# Altium schematic sheet COMM.SchDoc
size 420 x 297 mm; SheetNumber: 15; SheetTotal: 32
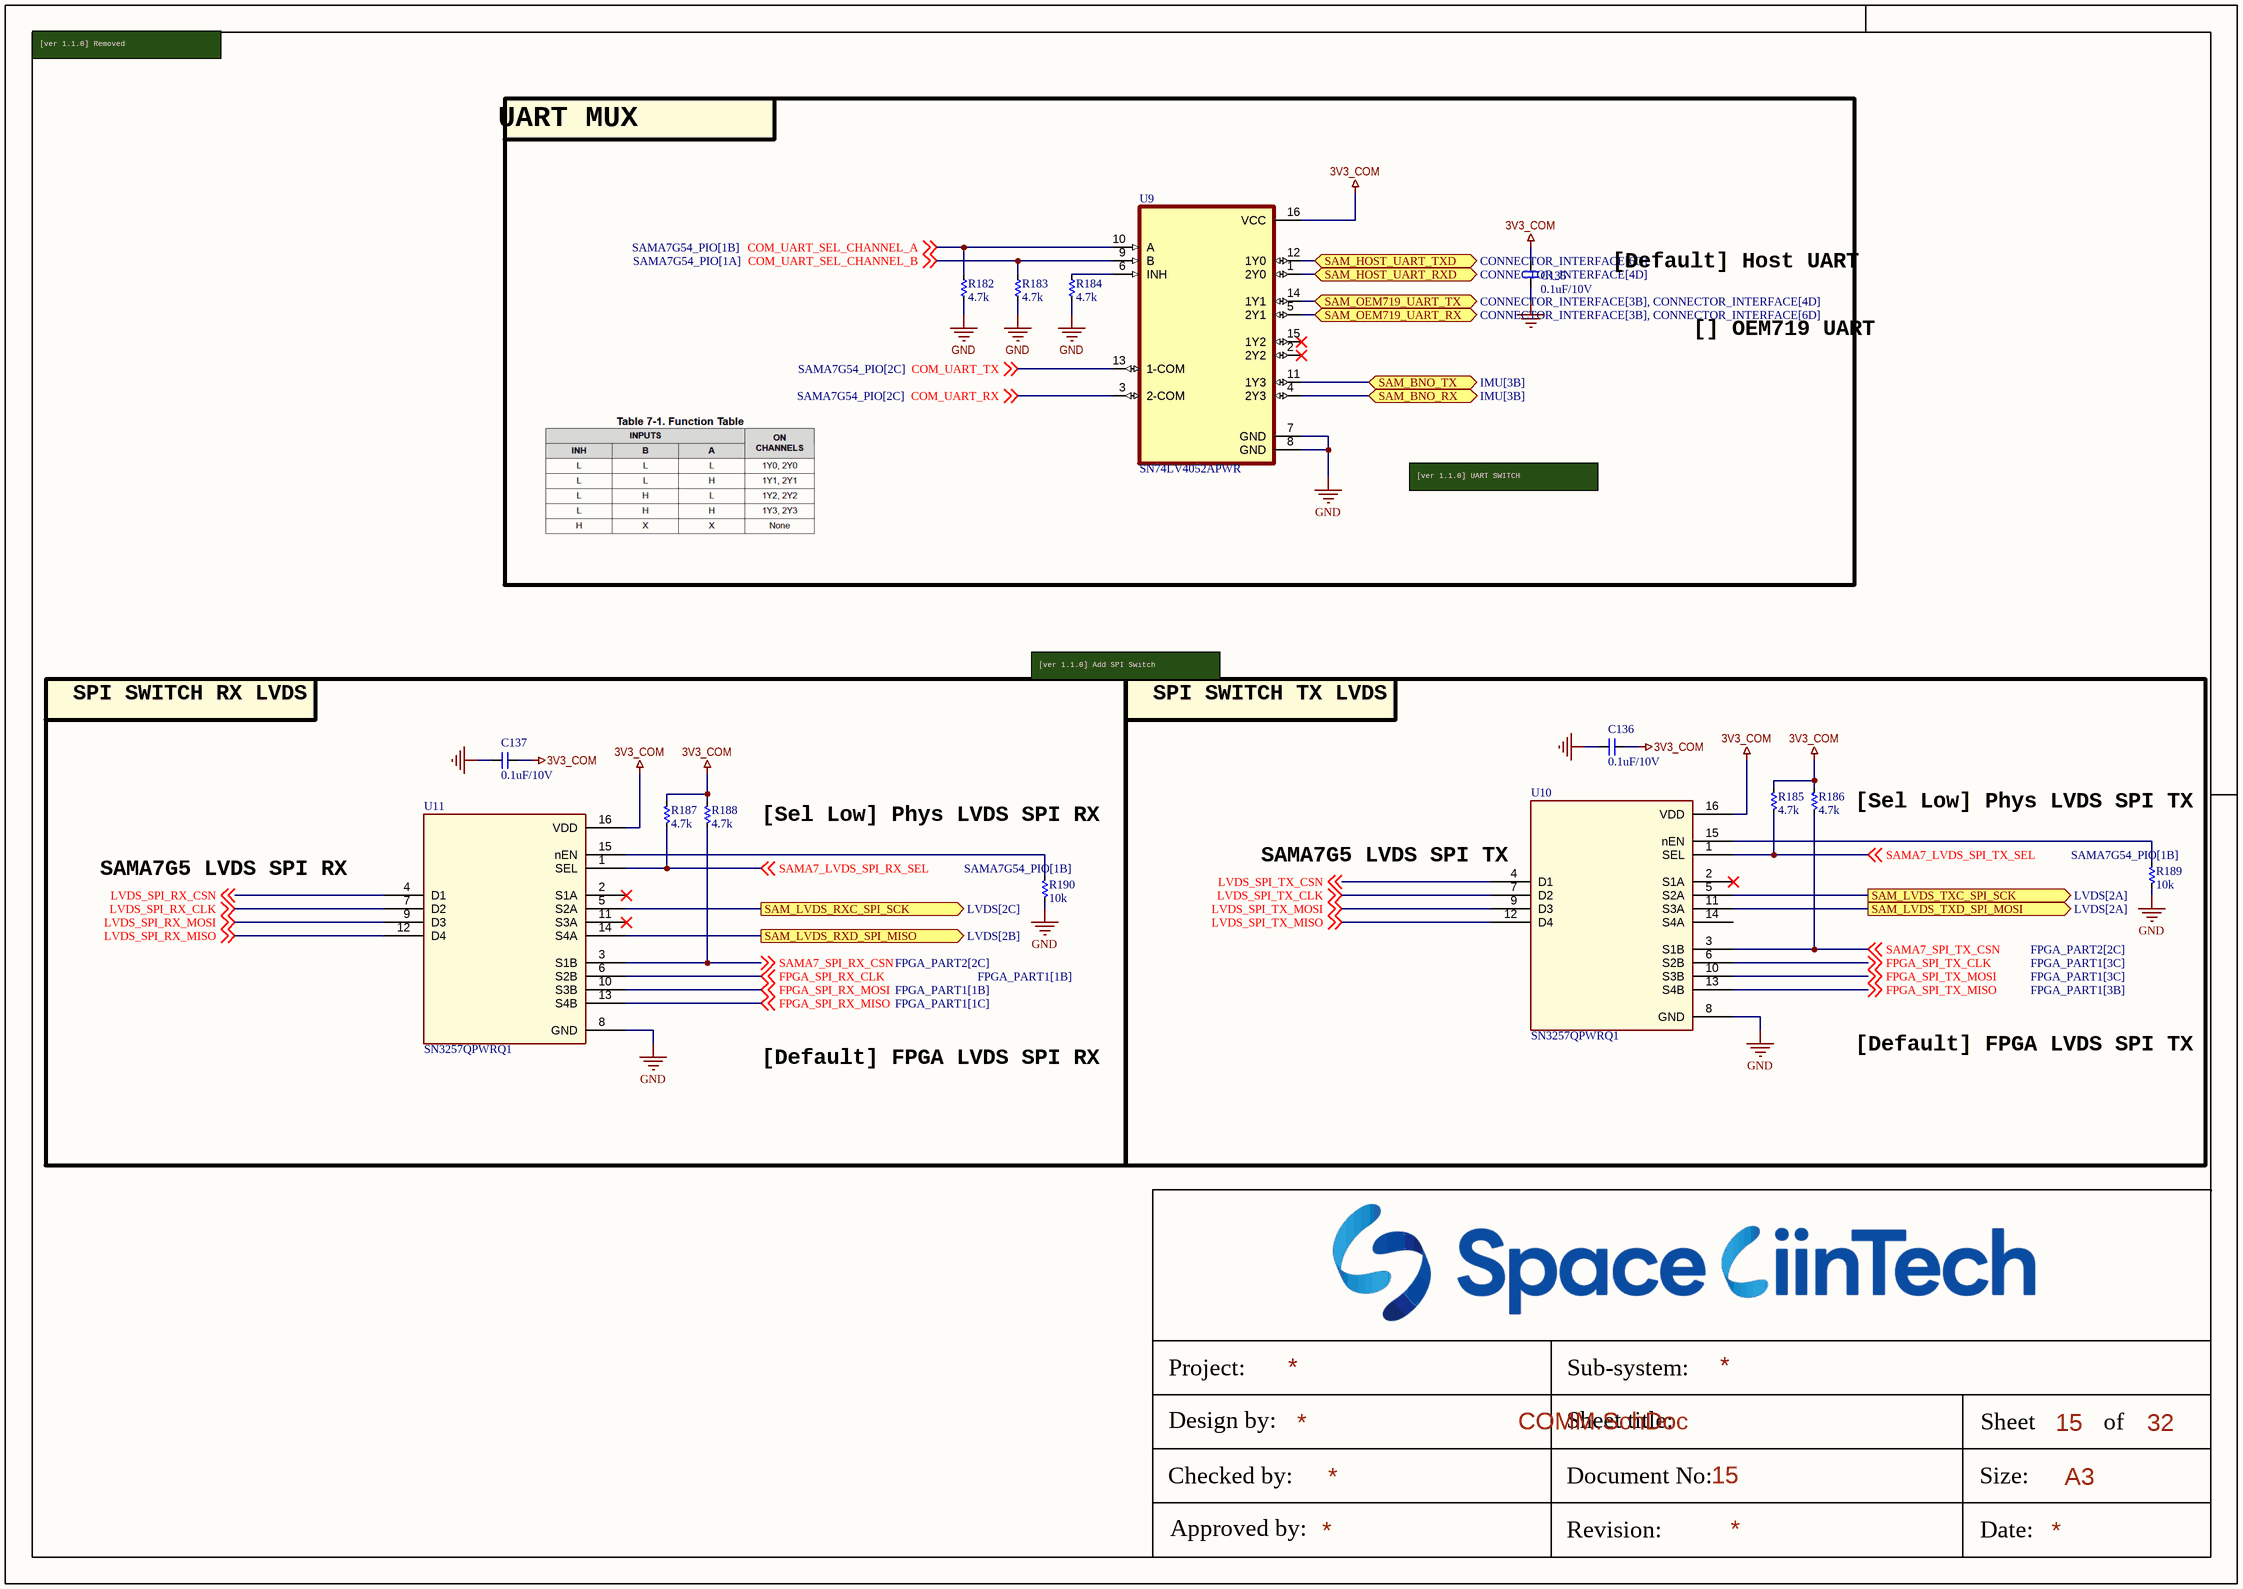
[diagram p0: COMM.SchDoc]

## Parts
C135  0.1uF/10V  [CAP_C_1005X50_L]
C136  0.1uF/10V  [CAP_C_1005X50_L]
C137  0.1uF/10V  [CAP_C_1005X50_L]
R182  4.7k  [RES_C_1005x30_L]
R183  4.7k  [RES_C_1005x30_L]
R184  4.7k  [RES_C_1005x30_L]
R185  4.7k  [RES_C_1005x30_L]
R186  4.7k  [RES_C_1005x30_L]
R187  4.7k  [RES_C_1005x30_L]
R188  4.7k  [RES_C_1005x30_L]
R189  10k  [RES_C_1005x30_L]
R190  10k  [RES_C_1005x30_L]
U9  SN74LV4052APWR  [SOP65P640X120-16N]
U10  SN3257QPWRQ1  [SOIC_PRQ1_TEX]
U11  SN3257QPWRQ1  [SOIC_PRQ1_TEX]

## Blocks framed on the sheet
UART MUX: C135 R182-R184 U9

## Ports
SAM_BNO_RX (bidir, see IMU[3B]), SAM_BNO_TX (bidir, see IMU[3B]), SAM_HOST_UART_RXD (bidir, see CONNECTOR_INTERFACE[4D]), SAM_HOST_UART_TXD (bidir, see CONNECTOR_INTERFACE[6D]), SAM_LVDS_RXC_SPI_SCK (out, see LVDS[2C]), SAM_LVDS_RXD_SPI_MISO (out, see LVDS[2B]), SAM_LVDS_TXC_SPI_SCK (out, see LVDS[2A]), SAM_LVDS_TXD_SPI_MOSI (out, see LVDS[2A]), SAM_OEM719_UART_RX (bidir, see CONNECTOR_INTERFACE[3B], CONNECTOR_INTERFACE[6D]), SAM_OEM719_UART_TX (bidir, see CONNECTOR_INTERFACE[3B], CONNECTOR_INTERFACE[4D])

## Nets
3V3_COM: C135.2 C136.2 C137.2 R185.2 R186.2 R187.2 R188.2 U9.16(VCC) U10.16(VDD) U11.16(VDD)
GND: C135.1 C136.1 C137.1 R182.2 R183.2 R184.2 R189.1 R190.1 U9.7(GND) U9.8(GND) U10.8(GND) U11.8(GND)
COM_UART_RX: U9.3(2-COM) ; off-sheet COM_UART_RX
COM_UART_SEL_CHANNEL_A: R182.1 U9.10(A) ; off-sheet COM_UART_SEL_CHANNEL_A
COM_UART_SEL_CHANNEL_B: R183.1 U9.9(B) ; off-sheet COM_UART_SEL_CHANNEL_B
COM_UART_TX: U9.13(1-COM) ; off-sheet COM_UART_TX
FPGA_SPI_RX_CLK: U11.6(S2B) ; off-sheet FPGA_SPI_RX_CLK
FPGA_SPI_RX_MISO: U11.13(S4B) ; off-sheet FPGA_SPI_RX_MISO
FPGA_SPI_RX_MOSI: U11.10(S3B) ; off-sheet FPGA_SPI_RX_MOSI
FPGA_SPI_TX_CLK: U10.6(S2B) ; off-sheet FPGA_SPI_TX_CLK
FPGA_SPI_TX_MISO: U10.13(S4B) ; off-sheet FPGA_SPI_TX_MISO
FPGA_SPI_TX_MOSI: U10.10(S3B) ; off-sheet FPGA_SPI_TX_MOSI
LVDS_SPI_RX_CLK: U11.7(D2) ; off-sheet LVDS_SPI_RX_CLK
LVDS_SPI_RX_CSN: U11.4(D1) ; off-sheet LVDS_SPI_RX_CSN
LVDS_SPI_RX_MISO: U11.12(D4) ; off-sheet LVDS_SPI_RX_MISO
LVDS_SPI_RX_MOSI: U11.9(D3) ; off-sheet LVDS_SPI_RX_MOSI
LVDS_SPI_TX_CLK: U10.7(D2) ; off-sheet LVDS_SPI_TX_CLK
LVDS_SPI_TX_CSN: U10.4(D1) ; off-sheet LVDS_SPI_TX_CSN
LVDS_SPI_TX_MISO: U10.12(D4) ; off-sheet LVDS_SPI_TX_MISO
LVDS_SPI_TX_MOSI: U10.9(D3) ; off-sheet LVDS_SPI_TX_MOSI
SAM_BNO_RX: U9.4(2Y3) ; port SAM_BNO_RX
SAM_BNO_TX: U9.11(1Y3) ; port SAM_BNO_TX
SAM_HOST_UART_RXD: U9.1(2Y0) ; port SAM_HOST_UART_RXD
SAM_HOST_UART_TXD: U9.12(1Y0) ; port SAM_HOST_UART_TXD
SAM_LVDS_RXC_SPI_SCK: U11.5(S2A) ; port SAM_LVDS_RXC_SPI_SCK
SAM_LVDS_RXD_SPI_MISO: U11.14(S4A) ; port SAM_LVDS_RXD_SPI_MISO
SAM_LVDS_TXC_SPI_SCK: U10.5(S2A) ; port SAM_LVDS_TXC_SPI_SCK
SAM_LVDS_TXD_SPI_MOSI: U10.11(S3A) ; port SAM_LVDS_TXD_SPI_MOSI
SAM_OEM719_UART_RX: U9.5(2Y1) ; port SAM_OEM719_UART_RX
SAM_OEM719_UART_TX: U9.14(1Y1) ; port SAM_OEM719_UART_TX
SAMA7_LVDS_SPI_RX_SEL: R187.1 U11.1(SEL) ; off-sheet SAMA7_LVDS_SPI_RX_SEL
SAMA7_LVDS_SPI_TX_SEL: R185.1 U10.1(SEL) ; off-sheet SAMA7_LVDS_SPI_TX_SEL
SAMA7_SPI_RX_CSN: R188.1 U11.3(S1B) ; off-sheet SAMA7_SPI_RX_CSN
SAMA7_SPI_TX_CSN: R186.1 U10.3(S1B) ; off-sheet SAMA7_SPI_TX_CSN
NetR184_1: R184.1 U9.6(INH)
NetR189_2: R189.2 U10.15(nEN)
NetR190_2: R190.2 U11.15(nEN)

Not connected (* = marked no-connect by the designer): U9 2(2Y2)* 15(1Y2)*; U10 2(S1A)* 14(S4A); U11 2(S1A)* 11(S3A)*

## Notes on the sheet
- [ver 1.1.0] Removed
- [Default] Host UART
- [] OEM719 UART
- [ver 1.1.0] UART SWITCH
- SPI SWITCH RX LVDS
- [ver 1.1.0] Add SPI Switch
- SPI SWITCH TX LVDS
- [Sel Low] Phys LVDS SPI RX
- SAMA7G5 LVDS SPI TX
- [Sel Low] Phys LVDS SPI TX
- SAMA7G5 LVDS SPI RX
- [Default] FPGA LVDS SPI RX
- [Default] FPGA LVDS SPI TX
- Project:
- Sub-system:
- Design by:
- Sheet title:
- Sheet
- A3
- of
- Checked by:
- Approved by:
- Revision:
- Document No:
- Size:
- Date:

## Library data of the parts
C135-C137 = _CAP_C_2: CAP
R182-R190 = _RES_B_2: RES
U9 = SN74LV4052APWR: 5-V, 4:1, 2-channel analog multiplexer; MF: Texas Instruments; SnapEDA_Link: https://www.snapeda.com/parts/SN74LV4052APWR/Texas+Instruments/view-part/?ref=snap; Package: TSSOP-16 Texas Instruments; Value: *; MP: SN74LV4052APWR; Check_prices: https://www.snapeda.com/parts/SN74LV4052APWR/Texas+Instruments/view-part/?ref=eda
U10 U11 = IC_SW_SPI_SN3257QPWRQ1: Automotive 5-V, 2:1 (SPDT), 4-channel switch with 1.8-V logic and powered-off protection 16-TSSOP -40 to 125; Manufacturer_Name: Texas Instruments; Copyright: Copyright (C) 2025 Ultra Librarian. All rights reserved.; Manufacturer_Part_Number: SN3257QPWRQ1; Datasheet: https://www.ti.com/lit/gpn/sn3257-q1; RefDes: RefDes; Type: Type